# EAGLE schematic Current sensors (EAGLE 8.2.1)
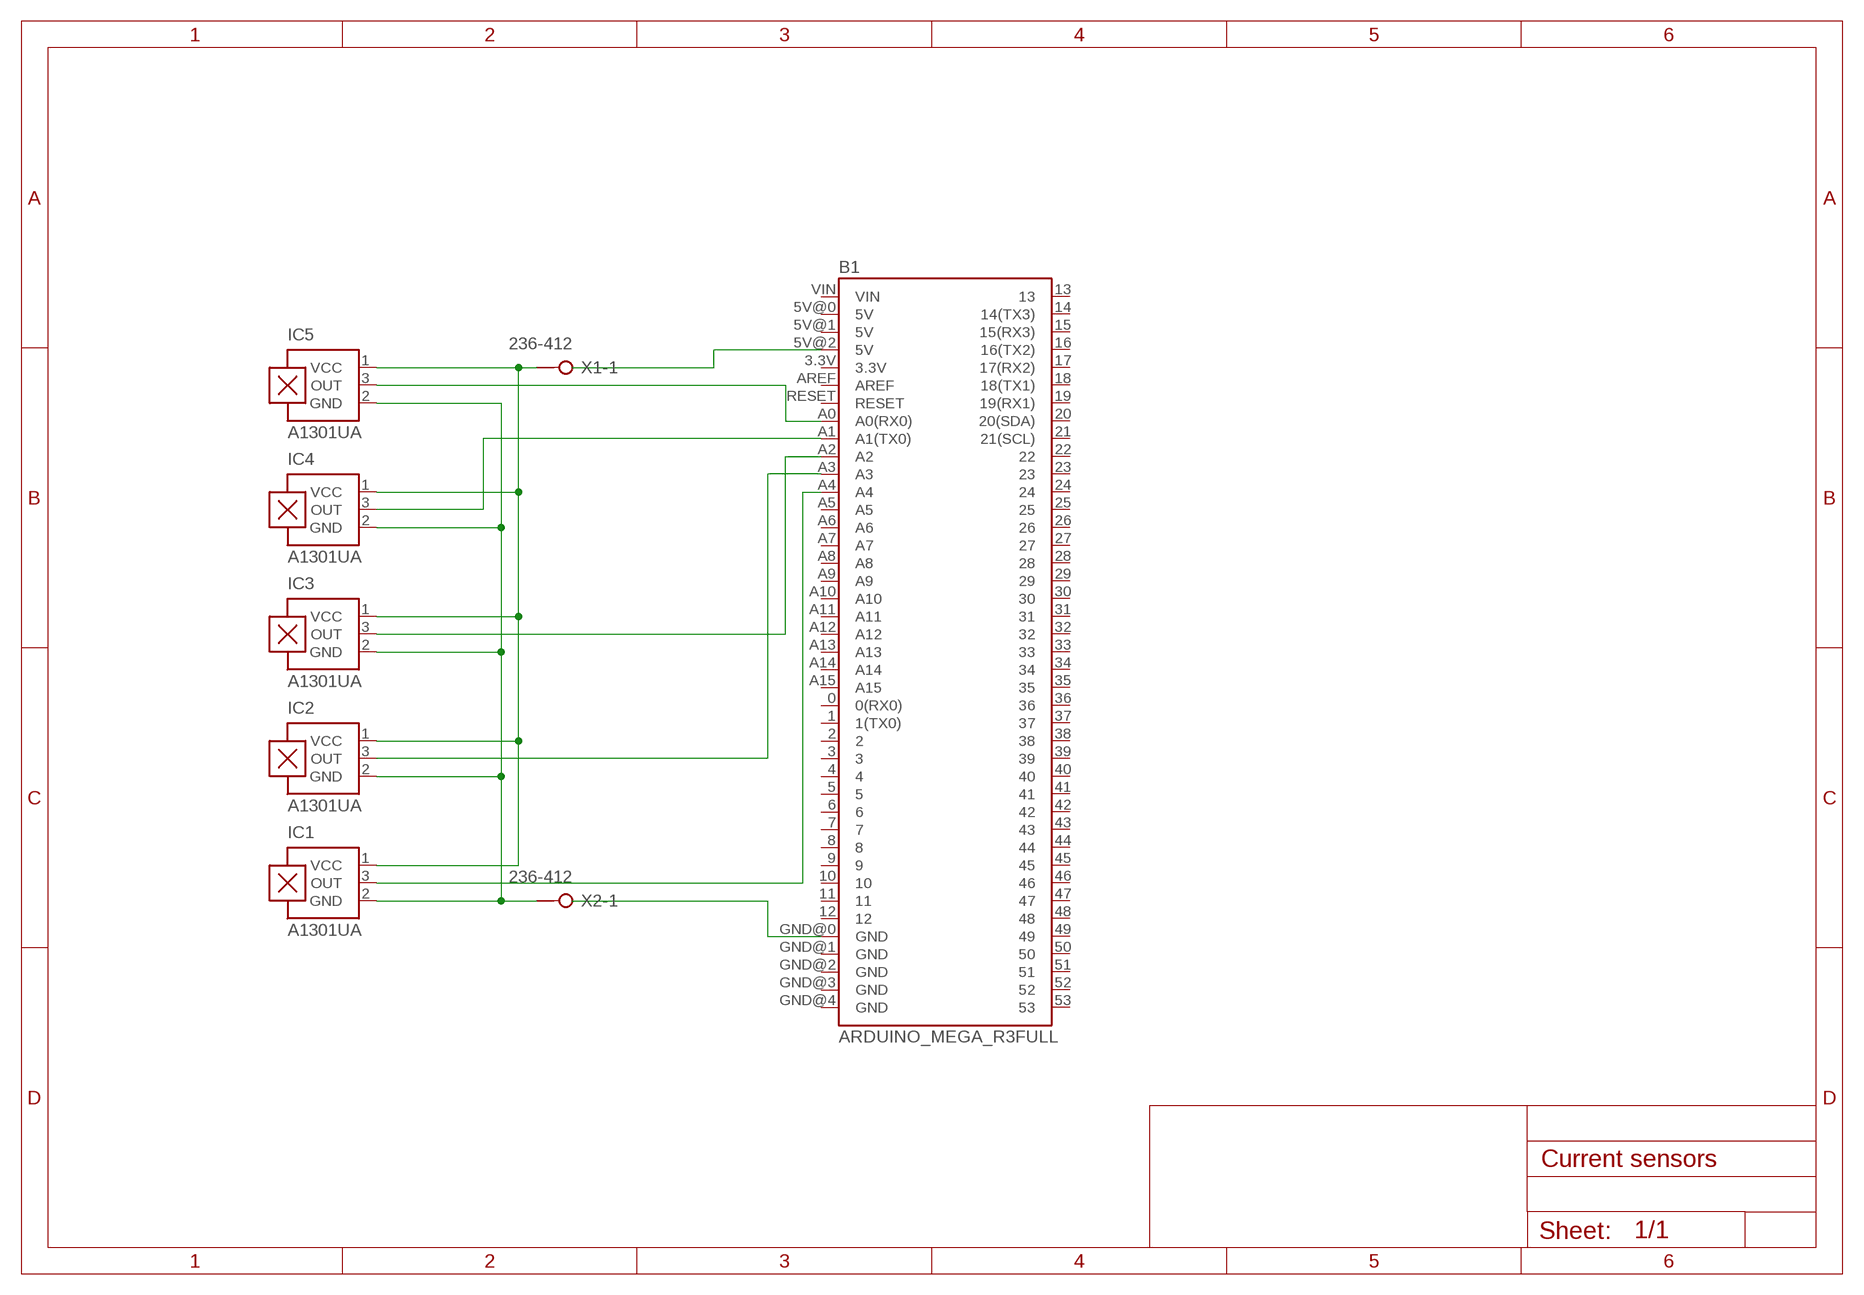
[diagram p0: schematic, sheet 1]

## Parts
B1  ARDUINO_MEGA_R3FULL  [ARDUINO_MEGA]
IC1  A1301UA  [SIP3-UA]
IC2  A1301UA  [SIP3-UA]
IC3  A1301UA  [SIP3-UA]
IC4  A1301UA  [SIP3-UA]
IC5  A1301UA  [SIP3-UA]
X1  236-412  [236-412]
X2  236-412  [236-412]

## Nets
N$1: IC1.1(VCC) IC2.1(VCC) IC3.1(VCC) IC4.1(VCC) IC5.1(VCC) X1.1@1(-1:KL1)
N$2: B1.5V@2(5V)
N$3: B1.GND@0(GND)
N$4: B1.A0(A0(RX0)) IC5.3(OUT)
N$5: B1.A1(A1(TX0)) IC4.3(OUT)
N$6: IC1.2(GND) IC2.2(GND) IC3.2(GND) IC4.2(GND) IC5.2(GND) X2.1@1(-1:KL1)
N$7: B1.A2 IC3.3(OUT)
N$8: B1.A3 IC2.3(OUT)
N$9: B1.A4 IC1.3(OUT)
Unconnected: B1.0(0(RX0)) B1.1(1(TX0)) B1.2 B1.3 B1.3.3V B1.4 B1.5 B1.5V@0(5V) B1.5V@1(5V) B1.6 B1.7 B1.8 B1.9 B1.10 B1.11 B1.12 B1.13 B1.14(14(TX3)) B1.15(15(RX3)) B1.16(16(TX2)) B1.17(17(RX2)) B1.18(18(TX1)) B1.19(19(RX1)) B1.20(20(SDA)) B1.21(21(SCL)) B1.22 B1.23 B1.24 B1.25 B1.26 B1.27 B1.28 B1.29 B1.30 B1.31 B1.32 B1.33 B1.34 B1.35 B1.36 B1.37 B1.38 B1.39 B1.40 B1.41 B1.42 B1.43 B1.44 B1.45 B1.46 B1.47 B1.48 B1.49 B1.50 B1.51 B1.52 B1.53 B1.A5 B1.A6 B1.A7 B1.A8 B1.A9 B1.A10 B1.A11 B1.A12 B1.A13 B1.A14 B1.A15 B1.AREF B1.GND@1(GND) B1.GND@2(GND) B1.GND@3(GND) B1.GND@4(GND) B1.RESET B1.VIN X1.1@2(-1:KL2) X1.2@1(-2:KL1) X1.2@2(-2:KL2) X1.3@1(-3:KL1) X1.3@2(-3:KL2) X1.4@1(-4:KL1) X1.4@2(-4:KL2) X1.5@1(-5:KL1) X1.5@2(-5:KL2) X1.6@1(-6:KL1) X1.6@2(-6:KL2) X1.7@1(-7:KL1) X1.7@2(-7:KL2) X1.8@1(-8:KL1) X1.8@2(-8:KL2) X1.9@1(-9:KL1) X1.9@2(-9:KL2) X1.10@1(-10:KL1) X1.10@2(-10:KL2) X1.11@1(-11:KL1) X1.11@2(-11:KL2) X1.12@1(-12:KL1) X1.12@2(-12:KL2) X2.1@2(-1:KL2) X2.2@1(-2:KL1) X2.2@2(-2:KL2) X2.3@1(-3:KL1) X2.3@2(-3:KL2) X2.4@1(-4:KL1) X2.4@2(-4:KL2) X2.5@1(-5:KL1) X2.5@2(-5:KL2) X2.6@1(-6:KL1) X2.6@2(-6:KL2) X2.7@1(-7:KL1) X2.7@2(-7:KL2) X2.8@1(-8:KL1) X2.8@2(-8:KL2) X2.9@1(-9:KL1) X2.9@2(-9:KL2) X2.10@1(-10:KL1) X2.10@2(-10:KL2) X2.11@1(-11:KL1) X2.11@2(-11:KL2) X2.12@1(-12:KL1) X2.12@2(-12:KL2)

## Library data of the parts
B1 = SparkFun-Boards:ARDUINO_MEGA_R3: Arduino Mega R3 ATmega2560 R3 compatible footprint. SparkFun Products: Arduino Mega 2560 R3 <https://www.sparkfun.com/products/11061>
IC1-IC5 = allegro:A13*?: Linear Hall Effect Sensor ICs Continuous-Time Ratiometric High-Temperature Operation Programmable Linear with Analog Output A1302 -Replacement- UGN3503 Source: http://www.allegromicro.com/en/Products/Part_Numbers/1301/1301.pdf http://www.allegromicro.com/en/Products/Part_Numbers/1321/1321.pdf http://www.allegromicro.com/en/Products/Part_Numbers/1381/1381.pdf; MF: ALLEGRO MICROSYSTEMS, INC.; MPN: A1301EUA-T; OC_FARNELL: 1198085; OC_NEWARK: 31K6635
X1 X2 = con-wago-508:236-412: Terminal Strips 2.5 mm2/AWG 12, Series 236, Pin Spacings 5/5.08 mm Source: Data sheet <http://www.farnell.com/datasheets/63479.pdf>; MF: Wago Corporation; MPN: 0236-0412; OC_FARNELL: 1283531; OC_NEWARK: 79K2064